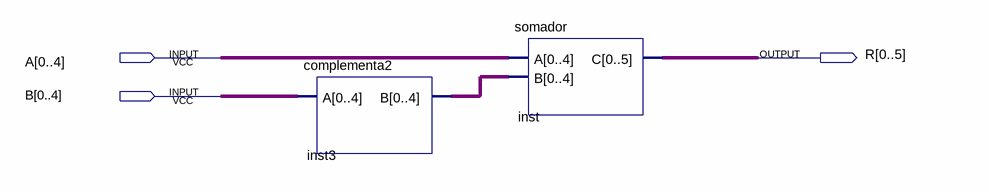
[diagram p0: schematic sheet]
// Quartus schematic subtrator.bdf as structural Verilog: 2 symbols, 3 pins
module subtrator (
  input  [0:4] A,
  input  [0:4] B,
  output [0:5] R
);

  wire [4:0] inst3_b;

  complementa2 inst3 (.A(B), .B(inst3_b));
  somador inst (.A(A), .B(inst3_b), .C(R));
endmodule
